# EAGLE schematic Schematic v4 (EAGLE 9.7.0)
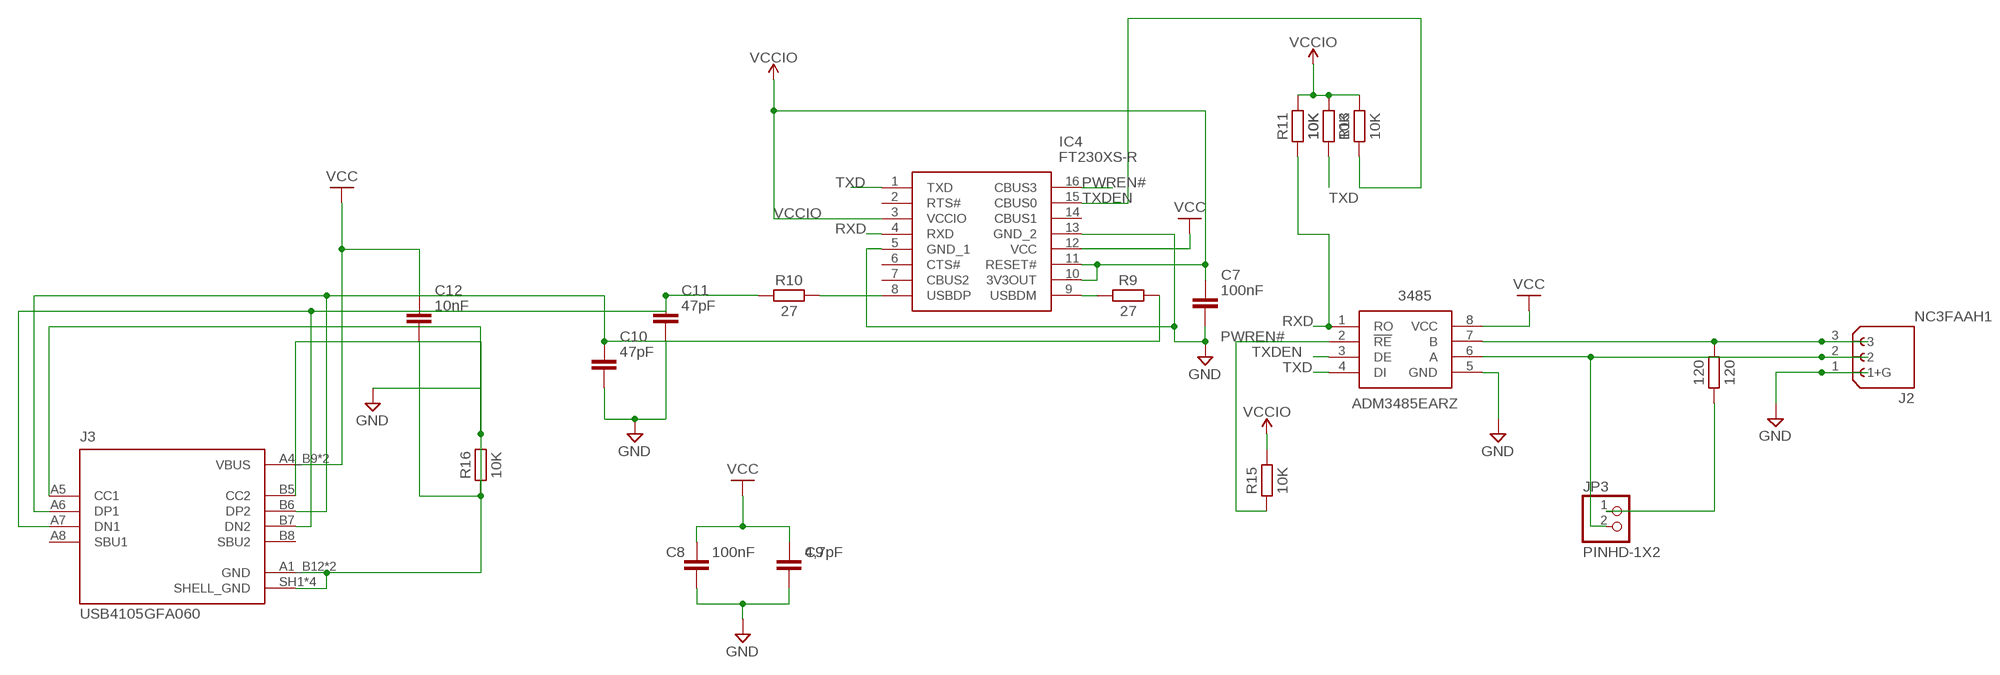
[diagram p0: schematic, sheet 1]

## Parts
10K  10K  R_CHIP-1206(3216-METRIC)  [RESC3216X70]
120  120  R_CHIP-1206(3216-METRIC)  [RESC3216X70]
3485  ADM3485EARZ  [SOIC127P600X175-8N]
C7  100nF  C_CHIP-1206(3216-METRIC)  [CAPC3216X135]
C8  100nF  C_CHIP-1206(3216-METRIC)  [CAPC3216X135]
C9  4,7pF  C_CHIP-1206(3216-METRIC)  [CAPC3216X135]
C10  47pF  C_CHIP-1206(3216-METRIC)  [CAPC3216X135]
C11  47pF  C_CHIP-1206(3216-METRIC)  [CAPC3216X135]
C12  10nF  C_CHIP-1206(3216-METRIC)  [CAPC3216X135]
IC4  FT230XS-R  [SOP64P599X175-16N]
J2  NC3FAAH1  [NEUTRIK_NC3FAAH1]
J3  USB4105GFA060  [GCT_USB4105GFA060]
JP3  PINHD-1X2  [1X02]
R9  27  R_CHIP-1206(3216-METRIC)  [RESC3216X70]
R10  27  R_CHIP-1206(3216-METRIC)  [RESC3216X70]
R11  10K  R_CHIP-1206(3216-METRIC)  [RESC3216X70]
R13  10K  R_CHIP-1206(3216-METRIC)  [RESC3216X70]
R15  10K  R_CHIP-1206(3216-METRIC)  [RESC3216X70]
R16  10K  R_CHIP-1206(3216-METRIC)  [RESC3216X70]

## Nets
GND: 3485.5(GND) C7.2 C8.2 C9.2 C10.2 C11.2 C12.2 IC4.5(GND_1) IC4.13(GND_2) J2.1(1+G) J3.A1_B12(GND) J3.B1_A12(GND) J3.SH1(SHELL_GND) J3.SH2(SHELL_GND) J3.SH3(SHELL_GND) J3.SH4(SHELL_GND) R16.1
N$10: 120.2 3485.7(B) J2.3
N$11: IC4.8(USBDP) R10.2
N$12: IC4.9(USBDM) R9.1
N$13: C11.1 J3.A7(DN1) J3.B7(DN2) R10.1
N$14: C10.1 J3.A6(DP1) J3.B6(DP2) R9.2
N$15: 120.1 JP3.1
N$16: 3485.6(A) J2.2 JP3.2
N$17: J3.A5(CC1) J3.B5(CC2) R16.2
PWREN#: 3485.2(!RE) IC4.16(CBUS3) R15.1
RXD: 3485.1(RO) IC4.4(RXD) R11.1
TXD: 10K.1 3485.4(DI) IC4.1(TXD)
TXDEN: 3485.3(DE) IC4.15(CBUS0) R13.1
VCC: 3485.8(VCC) C8.1 C9.1 C12.1 IC4.12(VCC) J3.A4_B9(VBUS) J3.B4_A9(VBUS)
VCCIO: 10K.2 C7.1 IC4.3(VCCIO) IC4.10(3V3OUT) IC4.11(RESET#) R11.2 R13.2 R15.2
Unconnected: IC4.2(RTS#) IC4.6(CTS#) IC4.7(CBUS2) IC4.14(CBUS1) J3.A8(SBU1) J3.B8(SBU2)

## Library data of the parts
10K 120 R9-R11 R13 R15 R16 = Resistor:R: Resistor Fixed - Generic; CATEGORY: Resistor; SUB-CATEGORY: Fixed
3485 = ADM3485EARZ:ADM3485EARZ: +/-15 kV ESD-Protected, 3.3 V,12 Mbps,EIA RS-485/RS-422 Transceiver Source: Datasheet <https://componentsearchengine.com/Datasheets/2/ADM3485EARZ.pdf>; DESCRIPTION: +/-15 kV ESD-Protected, 3.3 V,12 Mbps,EIA RS-485/RS-422 Transceiver; HEIGHT: 1.75mm; MANUFACTURER_NAME: Analog Devices; MANUFACTURER_PART_NUMBER: ADM3485EARZ; MOUSER_PART_NUMBER: 584-ADM3485EARZ; MOUSER_PRICE-STOCK: https://www.mouser.co.uk/ProductDetail/Analog-Devices/ADM3485EARZ?qs=BpaRKvA4VqHkSzuHRWJo4g%3D%3D
C7-C12 = Capacitor:C: Capacitor - Generic; CATEGORY: Capacitor
IC4 = FT230XS-R:FT230XS-R: UART Interface RS232, RS422, RS485, SIE, UART 3MBd, 5 V Source: Datasheet <http://www.ftdichip.com/Support/Documents/DataSheets/ICs/DS_FT230X.pdf>; DESCRIPTION: UART Interface RS232, RS422, RS485, SIE, UART 3MBd, 5 V; HEIGHT: 1.753mm; MANUFACTURER_NAME: FTDI Chip; MANUFACTURER_PART_NUMBER: FT230XS-R; MOUSER_PART_NUMBER: 895-FT230XS-R; MOUSER_PRICE-STOCK: https://www.mouser.co.uk/ProductDetail/FTDI/FT230XS-R?qs=Gp1Yz1mis3XyCLeYOseSng%3D%3D
J2 = NC3FAAH1:NC3FAAH1: Check availability <https://pricing.snapeda.com/parts/NC3FAAH1/Neutrik/view-part?ref=eda>; AVAILABILITY: In Stock; CHECK_PRICES: https://www.snapeda.com/parts/NC3FAAH1/Neutrik/view-part/?ref=eda; DESCRIPTION: 3 pole female XLR receptacle, grounding: mating connector shell to pin1 and front panel, horizontal PCB mount; MF: Neutrik; MP: NC3FAAH1; PACKAGE: None; PRICE: None; SNAPEDA_LINK: https://www.snapeda.com/parts/NC3FAAH1/Neutrik/view-part/?ref=snap
J3 = USB4105GFA060:USB4105GFA060: Check availability <https://pricing.snapeda.com/parts/USB4105GFA060/Global%20Connector%20Technology/view-part?ref=eda>; AVAILABILITY: In Stock; CHECK_PRICES: https://www.snapeda.com/parts/USB4105GFA060/Global+Connector+Technology/view-part/?ref=eda; DESCRIPTION: USB-C (USB TYPE-C) USB 2.0 Receptacle Connector 24 (16+8 Dummy) Position Surface Mount, Right Angle; Through Hole; MF: Global Connector Technology; MP: USB4105GFA060; PACKAGE: None; PRICE: None; SNAPEDA_LINK: https://www.snapeda.com/parts/USB4105GFA060/Global+Connector+Technology/view-part/?ref=snap
JP3 = Connector:PINHD-1X2: PIN HEADER; CATEGORY: Headers; DESCRIPTION: Header, Straight, 2 Position; MANUFACTURER: Generic; MPN: Generic; OPERATING_TEMPERATURE: Generic; PART_STATUS: Active; PITCH: 0.100" (2.54mm); ROHS_COMPLIANCE: Generic; SERIES: Generic; SUB-CATEGORY: Headers, Male Pins; TYPE: Board to Board or Cable, Unshrouded, Through Hole, Straight